# Altium schematic sheet EXTSFR.SCHDOC
size A4; Organization: Microprocessor-Design Pty Ltd; Address1: 18/110 Caroline Street; Address2: South Yarra; Address3: VIC 3141; Address4: Australia; DocumentNumber: 2; SheetNumber: 2; SheetTotal: 3
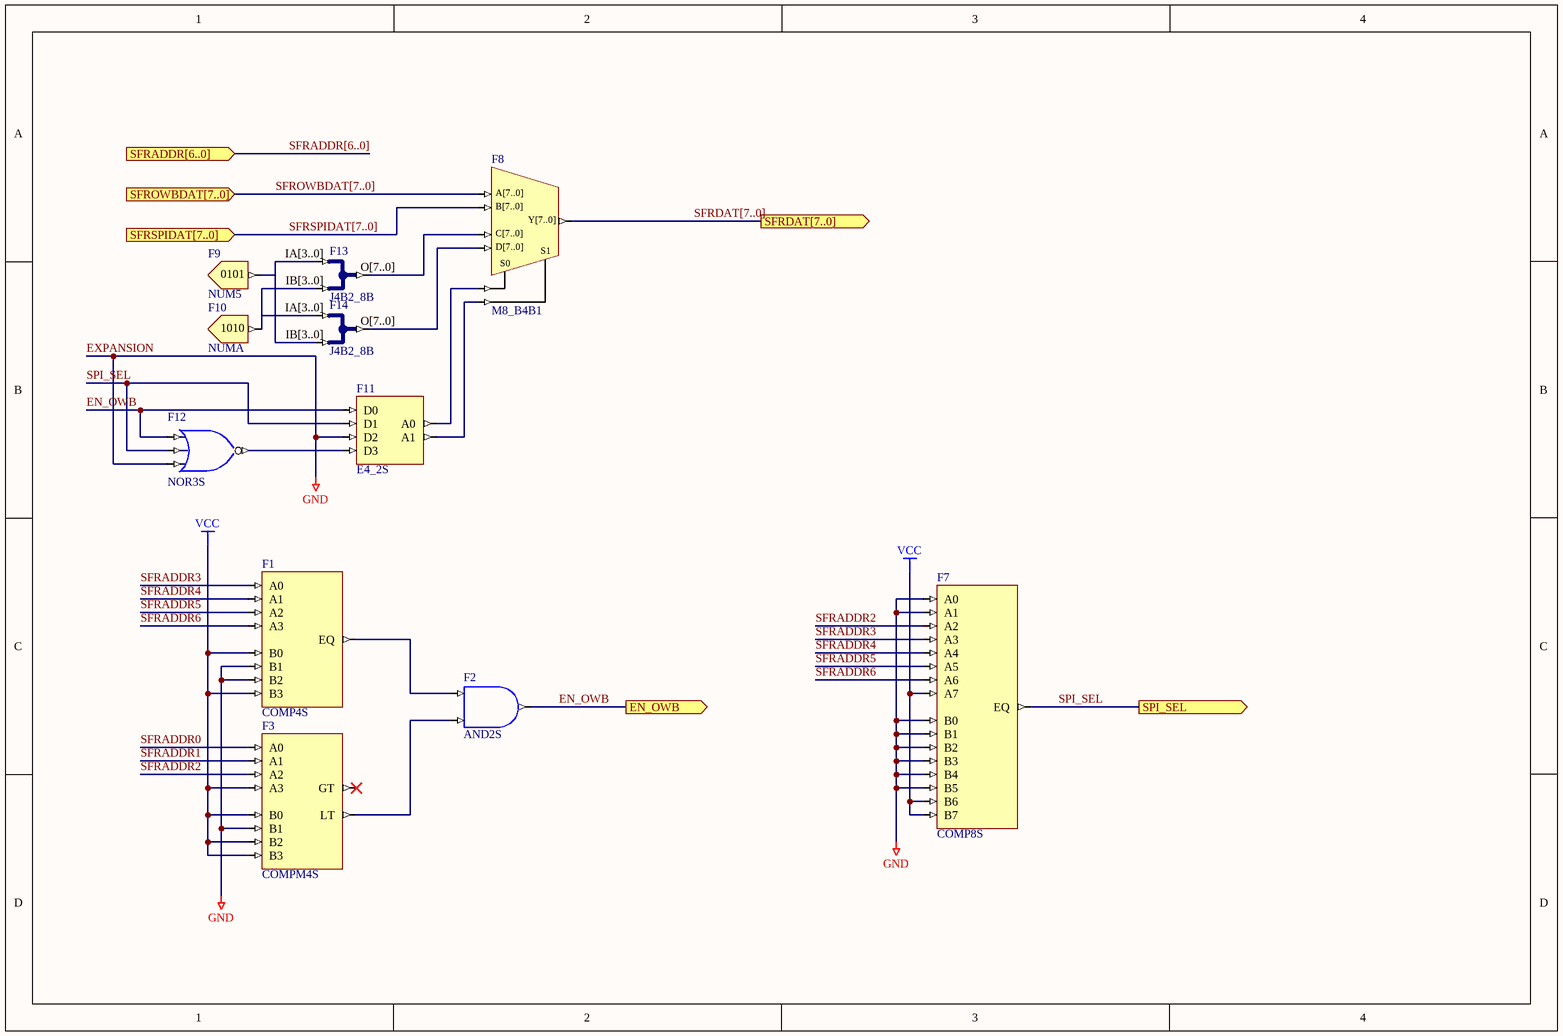
[diagram p0: EXTSFR.SCHDOC]

## Parts
F1  COMP4S
F2  AND2S
F3  COMPM4S
F7  COMP8S
F8  M8_B4B1
F9  NUM5
F10  NUMA
F11  E4_2S
F12  NOR3S
F13  J4B2_8B
F14  J4B2_8B

## Ports
EN_OWB (out), SFRADDR[6..0] (in), SFRDAT[7..0] (out), SFROWBDAT[7..0] (in), SFRSPIDAT[7..0] (in), SPI_SEL (out)

## Nets
EXPANSION: F1.B1 F1.B2 F3.B1 F7.A0 F7.A1 F7.B0 F7.B1 F7.B2 F7.B3 F7.B4 F7.B5 F11.D2 F12.I2  [also labelled GND]
VCC: F1.B0 F1.B3 F3.A3 F3.B0 F3.B2 F3.B3 F7.A7 F7.B6 F7.B7
EN_OWB: F2.O F11.D0 F12.I0 ; port EN_OWB
SFRADDR0: F3.A0
SFRADDR1: F3.A1
SFRADDR2: F3.A2 F7.A2
SFRADDR3: F1.A0 F7.A3
SFRADDR4: F1.A1 F7.A4
SFRADDR5: F1.A2 F7.A5
SFRADDR6: F1.A3 F7.A6
SFRDAT[7..0]: F8.Y[7..0] ; port SFRDAT[7..0]
SFROWBDAT[7..0]: F8.A[7..0] ; port SFROWBDAT[7..0]
SFRSPIDAT[7..0]: F8.B[7..0] ; port SFRSPIDAT[7..0]
SPI_SEL: F7.EQ F11.D1 F12.I1 ; port SPI_SEL
NetF1_EQ: F1.EQ F2.I0
NetF2_I1: F2.I1 F3.LT
NetF8_C[7..0]: F8.C[7..0] F13.O[7..0]
NetF8_D[7..0]: F8.D[7..0] F14.O[7..0]
NetF8_S0: F8.S0 F11.A0
NetF8_S1: F8.S1 F11.A1
NetF9_O[3..0]: F9.O[3..0] F13.IA[3..0] F14.IB[3..0]
NetF10_O[3..0]: F10.O[3..0] F13.IB[3..0] F14.IA[3..0]
NetF11_D3: F11.D3 F12.O

Not connected (* = marked no-connect by the designer): F3 GT*

## Buses and harness runs
bus SFRADDR[6..0] = port SFRADDR[6..0]
bus SFRDAT[7..0] = port SFRDAT[7..0]
bus SFROWBDAT[7..0] = port SFROWBDAT[7..0]
bus SFRSPIDAT[7..0] = port SFRSPIDAT[7..0]

## Notes on the sheet
- Title
- Size:
- Date:
- A4
- Number:
- Time:
- Revision:
- Sheet
- of
- File:
- (in symbol NUM5) 0101
- (in symbol NUMA) 1010

## Library data of the parts
F1 = COMP4S: 4-Bit Identity Comparator, Single Pin Version; Xilinx Equivalent: COMP4; ArchiveName: GENERIC; Published: 9-30-2003; Publisher: Altium Limited; Core Revision: 1.00.00
F2 = AND2S: 2-Input AND Gate, Single Pin Version; Xilinx Equivalent: AND2; ArchiveName: GENERIC; Published: 9-30-2003; Publisher: Altium Limited; Core Revision: 1.00.00
F3 = COMPM4S: 4-Bit Magnitude Comparator, Single Pin Version; Xilinx Equivalent: COMPM4; ArchiveName: GENERIC; Published: 9-30-2003; Publisher: Altium Limited; Core Revision: 1.00.00
F7 = COMP8S: 8-Bit Identity Comparator, Single Pin Version; ArchiveName: GENERIC; Published: 9-30-2003; Publisher: Altium Limited; Core Revision: 1.00.00
F8 = M8_B4B1: 4x8-Bit Bus to 1x8-Bit Bus Multiplexer; ArchiveName: GENERIC; Published: 9-30-2003; Publisher: Altium Limited; Core Revision: 1.00.00
F9 = NUM5: Number Connecter 5; ArchiveName: GENERIC; Published: 9-30-2003; Publisher: Altium Limited; Core Revision: 1.00.00
F10 = NUMA: Number Connecter A; ArchiveName: GENERIC; Published: 9-30-2003; Publisher: Altium Limited; Core Revision: 1.00.00
F11 = E4_2S: 4- to 2-Bit Priority Encoder, Single Pin Version; ArchiveName: GENERIC; Published: 9-30-2003; Publisher: Altium Limited; Core Revision: 1.00.00
F12 = NOR3S: 3-Input NOR Gate, Single Pin Version; Xilinx Equivalent: NOR3; ArchiveName: GENERIC; Published: 9-30-2003; Publisher: Altium Limited; Core Revision: 1.00.00
F13 F14 = J4B2_8B: 2 x 4-Bit input bus to 1 x 8-bit output bus; ArchiveName: GENERIC; Published: 9-30-2003; Publisher: Altium Limited; Core Revision: 1.00.00